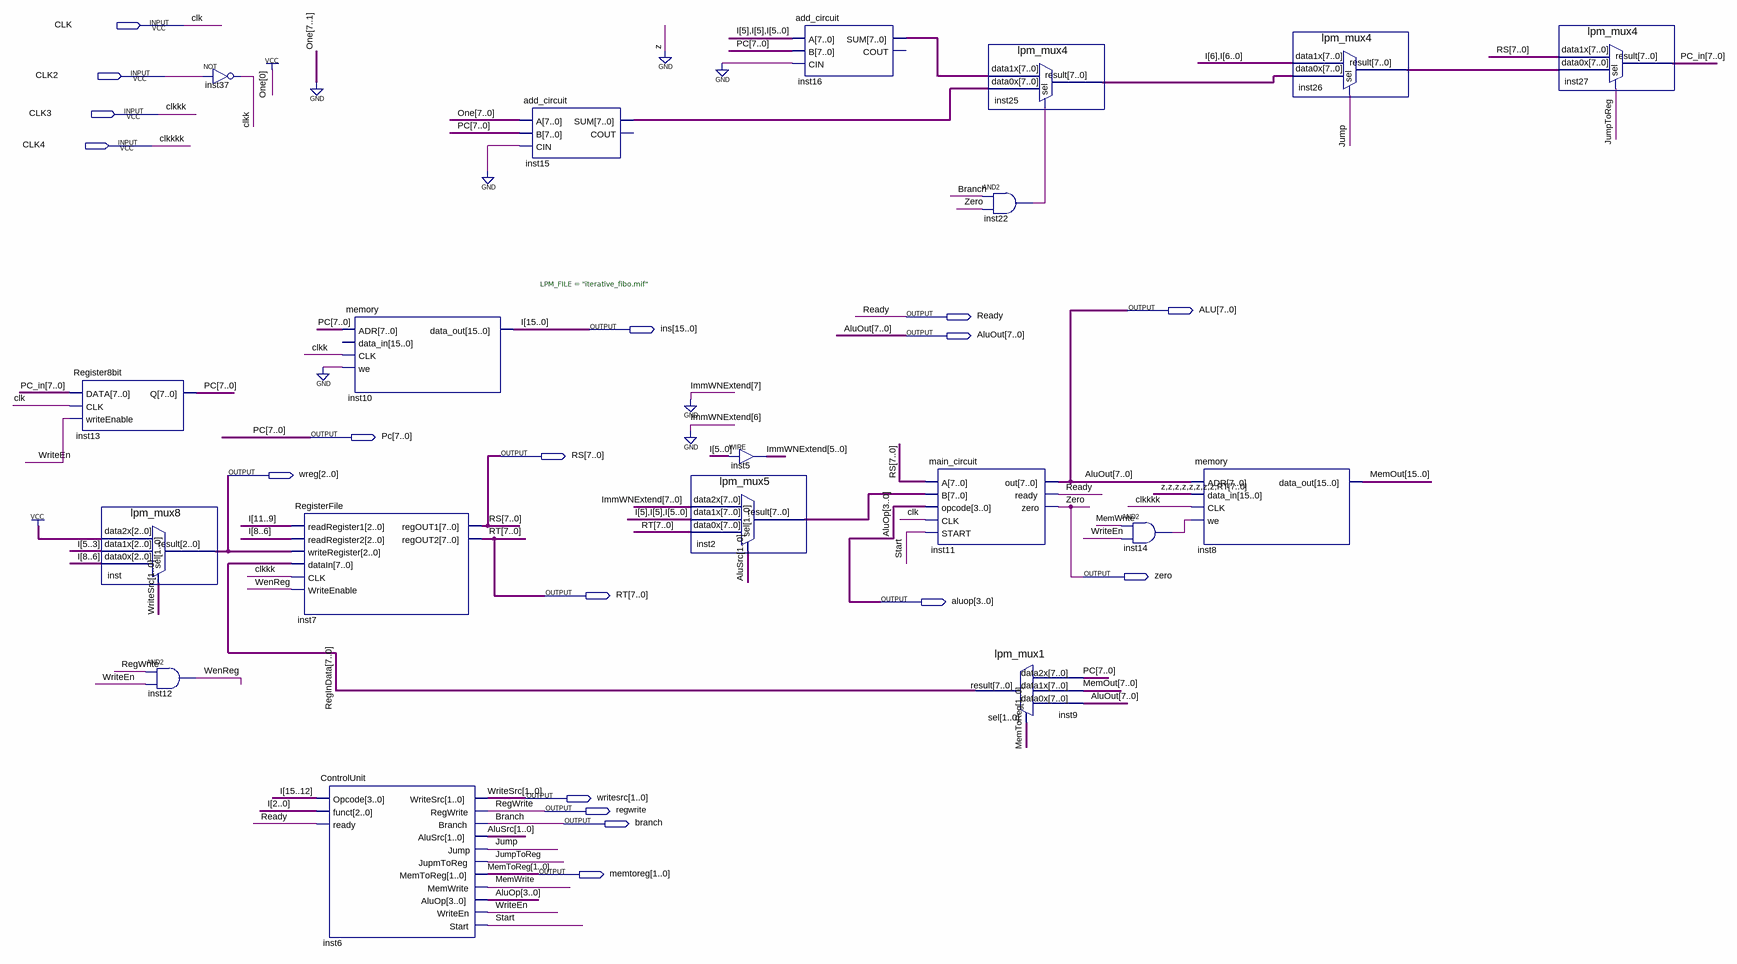
[diagram p0: schematic sheet]
// Quartus schematic MipsDataPath.bdf as structural Verilog: 19 symbols, 18 pins
module MipsDataPath (
  input  CLK,
  input  CLK2,
  input  CLK3,
  input  CLK4,
  output [7:0] ALU,
  output Ready,
  output [15:0] ins,
  output [7:0] AluOut,
  output [7:0] Pc,
  output [7:0] RS,
  output [2:0] wreg,
  output zero,
  output [7:0] RT,
  output [3:0] aluop,
  output [1:0] writesrc,
  output regwrite,
  output branch,
  output [1:0] memtoreg
);

  wire clkk, inst14_out, inst22_out, Jump, JumpToReg, MemWrite, Start, WenReg, WriteEn;
  wire [1:0] AluSrc;
  wire [5:0] ImmWNExtend;
  wire [7:0] inst2_result, inst15_sum, inst16_sum, inst25_result, inst26_result, PC_in, RegInData;
  wire [15:0] MemOut;

  Register8bit inst13 (.DATA(PC_in), .CLK(CLK), .writeEnable(WriteEn), .Q(Pc));
  lpm_mux8 inst (.data2x(3'b111), .data1x(ins[5:3]), .data0x(ins[8:6]), .sel(writesrc), .result(wreg));
  and inst12 (WenReg, regwrite, WriteEn);
  not inst37 (clkk, CLK2);
  RegisterFile inst7 (
    .CLK(CLK3), .WriteEnable(WenReg), .dataIn(RegInData), .readRegister1(ins[11:9]),
    .readRegister2(ins[8:6]), .writeRegister(wreg), .regOUT1(RS), .regOUT2(RT));
  ControlUnit inst6 (
    .Opcode(ins[15:12]), .funct(ins[2:0]), .ready(Ready), .WriteSrc(writesrc), .RegWrite(regwrite),
    .Branch(branch), .AluSrc(AluSrc), .Jump(Jump), .JupmToReg(JumpToReg), .MemToReg(memtoreg),
    .MemWrite(MemWrite), .AluOp(aluop), .WriteEn(WriteEn), .Start(Start));
  memory #(.LPM_FILE("iterative_fibo.mif")) inst10 (.ADR(Pc), .CLK(clkk), .we(1'b0), .data_out(ins));  // open: data_in
  add_circuit inst15 (.A(8'b00000001), .B(Pc), .CIN(1'b0), .SUM(inst15_sum));  // open: COUT
  assign ImmWNExtend = ins[5:0];  // WIRE inst5
  lpm_mux5 inst2 (
    .data2x({2'b00, ImmWNExtend}), .data1x({{3{ins[5]}}, ins[4:0]}), .data0x(RT), .sel(AluSrc),
    .result(inst2_result));
  add_circuit inst16 (.A({{3{ins[5]}}, ins[4:0]}), .B(Pc), .CIN(1'b0), .SUM(inst16_sum));  // open: COUT
  main_circuit inst11 (
    .A(RS), .B(inst2_result), .opcode(aluop), .CLK(CLK), .START(Start), .out(ALU), .ready(Ready), .zero(zero));
  lpm_mux4 inst25 (.data1x(inst16_sum), .data0x(inst15_sum), .sel(inst22_out), .result(inst25_result));
  and inst22 (inst22_out, branch, zero);
  lpm_mux1 inst9 (.data2x(Pc), .data1x(MemOut[7:0]), .data0x(ALU), .sel(memtoreg), .result(RegInData));
  and inst14 (inst14_out, MemWrite, WriteEn);
  memory inst8 (.ADR(ALU), .data_in({{8{1'b0}}, RT}), .CLK(CLK4), .we(inst14_out), .data_out(MemOut));
  lpm_mux4 inst26 (.data1x({{2{ins[6]}}, ins[5:0]}), .data0x(inst25_result), .sel(Jump), .result(inst26_result));
  lpm_mux4 inst27 (.data1x(RS), .data0x(inst26_result), .sel(JumpToReg), .result(PC_in));

  assign AluOut = ALU;

  // Other names for the same wires on the sheet: clkkk = CLK3; clkkkk = CLK4; I[15:0] = ins
endmodule
